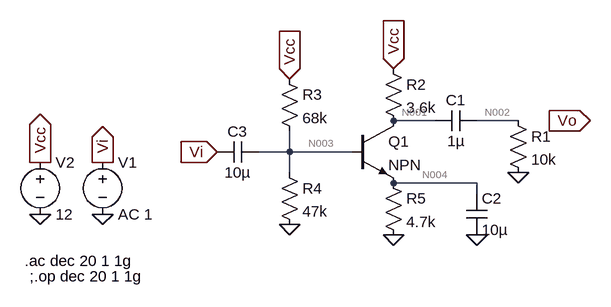
[diagram p0: schematic March07.asc]
March07.asc, the LTspice schematic file:
Version 4
SHEET 1 880 680
WIRE 272 144 208 144
WIRE 400 144 336 144
WIRE 48 192 48 160
WIRE 48 192 0 192
WIRE 144 192 48 192
WIRE 48 224 48 192
WIRE 336 240 208 240
WIRE 336 256 336 240
FLAG -64 192 Vi
IOPIN -64 192 In
FLAG 48 304 0
FLAG 208 320 0
FLAG 336 320 0
FLAG 400 224 0
FLAG 208 64 Vcc
IOPIN 208 64 In
FLAG 48 80 Vcc
IOPIN 48 80 In
FLAG -240 288 0
FLAG -336 288 0
FLAG -336 208 Vcc
IOPIN -336 208 Out
FLAG -240 208 Vi
IOPIN -240 208 Out
FLAG 448 144 Vo
IOPIN 448 144 Out
SYMBOL npn 144 144 R0
SYMATTR InstName Q1
SYMBOL cap 336 128 R90
WINDOW 0 0 32 VBottom 2
WINDOW 3 32 32 VTop 2
SYMATTR InstName C1
SYMATTR Value 1µ
SYMBOL res 384 128 R0
SYMATTR InstName R1
SYMATTR Value 10k
SYMBOL res 192 48 R0
SYMATTR InstName R2
SYMATTR Value 3.6k
SYMBOL res 32 64 R0
SYMATTR InstName R3
SYMATTR Value 68k
SYMBOL res 32 208 R0
SYMATTR InstName R4
SYMATTR Value 47k
SYMBOL res 192 224 R0
SYMATTR InstName R5
SYMATTR Value 4.7k
SYMBOL cap 320 256 R0
SYMATTR InstName C2
SYMATTR Value 10µ
SYMBOL cap 0 176 R90
WINDOW 0 0 32 VBottom 2
WINDOW 3 32 32 VTop 2
SYMATTR InstName C3
SYMATTR Value 10µ
SYMBOL voltage -240 192 R0
WINDOW 123 0 0 Left 0
WINDOW 39 0 0 Left 0
SYMATTR InstName V1
SYMATTR Value AC 1
SYMBOL voltage -336 192 R0
WINDOW 123 0 0 Left 0
WINDOW 39 0 0 Left 0
SYMATTR InstName V2
SYMATTR Value 12
TEXT -360 360 Left 2 !.ac dec 20 1 1g
TEXT -352 384 Left 2 !;.op dec 20 1 1g

The netlist it stands for:
* March07.asc
Q1 N001 N003 N004 0 NPN
C1 N002 N001 1µ
R1 N002 0 10k
R2 Vcc N001 3.6k
R3 Vcc N003 68k
R4 N003 0 47k
R5 N004 0 4.7k
C2 N004 0 10µ
C3 N003 Vi 10µ
V1 Vi 0 AC 1
V2 Vcc 0 12
.model NPN NPN
.model PNP PNP
.lib standard.bjt
.ac dec 20 1 1g
;.op dec 20 1 1g
.backanno
.end

* Results of the author's LTspice run, read from the files saved beside the schematic
* Operating Point, zero values left out:
*   V(n001) = 9.037 V
*   V(n003) = 4.676 V
*   V(n004) = 3.906 V
*   V(vcc) = 12 V
*   Ic(Q1) = 823 µA
*   Ib(Q1) = 8.23 µA
*   Ie(Q1) = -831.2 µA
*   I(R2) = 822.9 µA
*   I(R3) = 107.7 µA
*   I(R4) = 99.48 µA
*   I(R5) = 831.2 µA
*   I(V2) = -930.6 µA
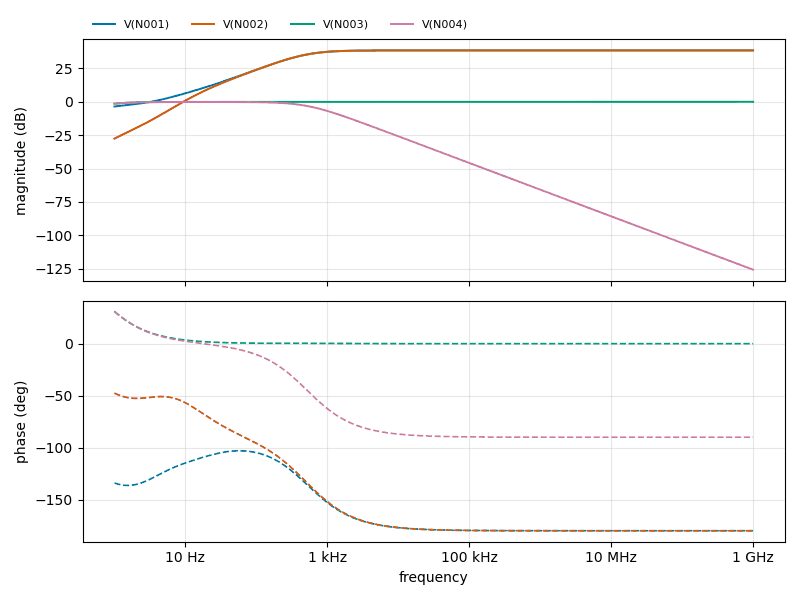
[diagram p1: AC Analysis of March07.asc, plotted from the saved traces]
* AC Analysis, 1 run:
*   V(N001): -3.53 dB at 1 Hz, 38.51 dB at 1 GHz, peak 38.51 dB at 1 GHz, 3 dB below the peak at 520.4 Hz
*   V(N002): -27.58 dB at 1 Hz, 38.51 dB at 1 GHz, peak 38.51 dB at 1 GHz, 3 dB below the peak at 520.9 Hz
*   V(N003): -1.42 dB at 1 Hz, -0.00 dB at 1 GHz, peak -0.00 dB at 1 GHz
*   V(N004): -1.48 dB at 1 Hz, -125.82 dB at 1 GHz, peak -0.15 dB at 17.78 Hz, 3 dB below the peak at 520.3 Hz